# Altium schematic sheet Sheet1.SchDoc
size A; SheetNumber: 1; SheetTotal: 3
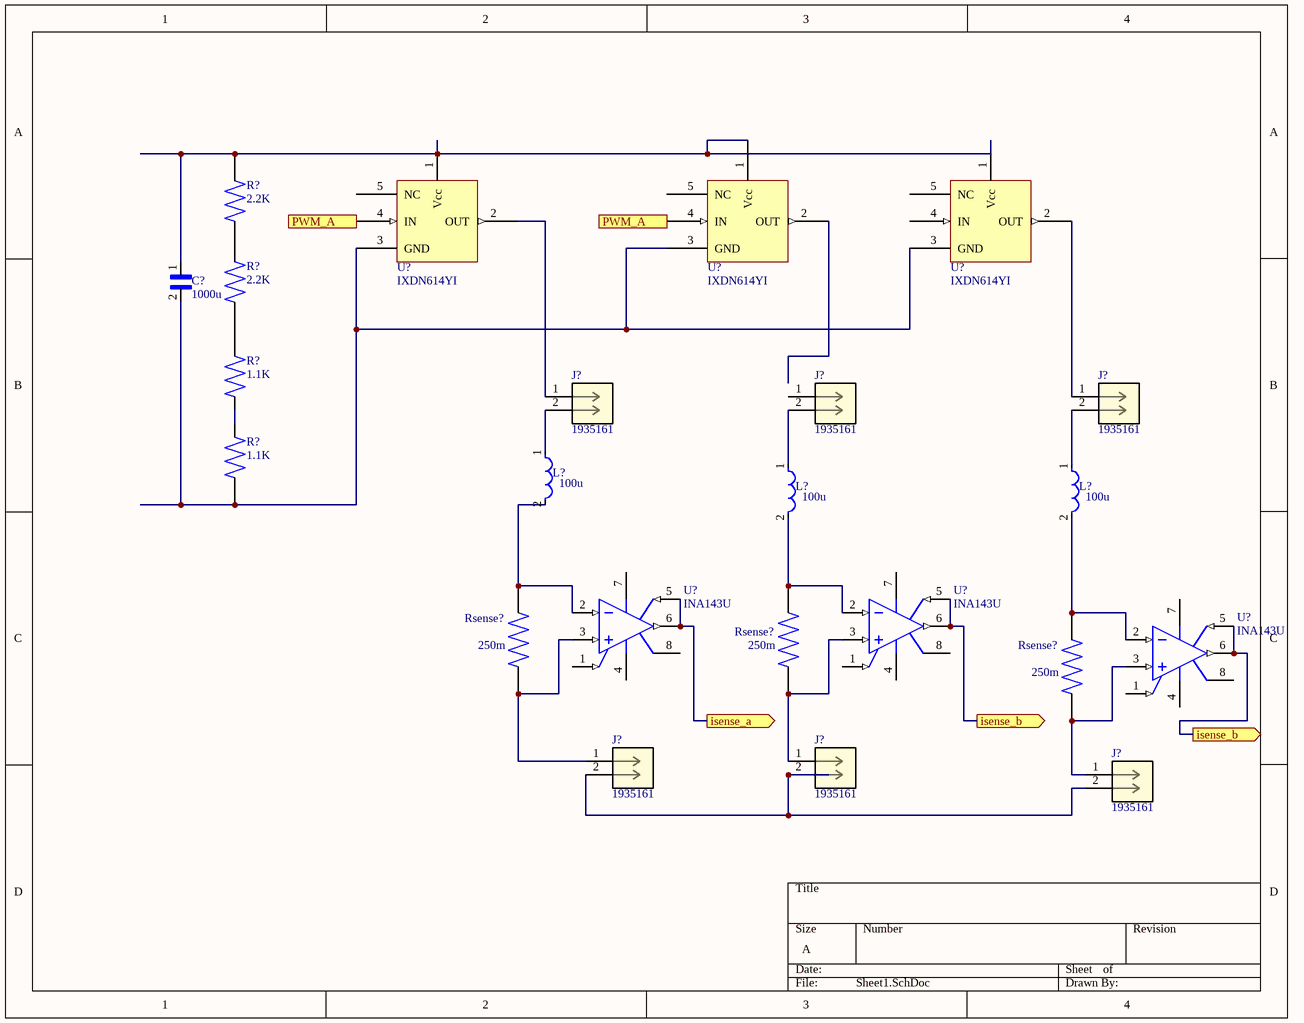
[diagram p0: Sheet1.SchDoc]

## Parts
(Parts that share a designator on the sheet are numbered #1, #2 ... from top to bottom, then left to right.)
C?  1000u
J?#1  1935161
J?#2  1935161
J?#3  1935161
J?#4  1935161
J?#5  1935161
J?#6  1935161
L?#1  100u
L?#2  100u
L?#3  100u
R?#1  2.2K
R?#2  2.2K
R?#3  1.1K
R?#4  1.1K
Rsense?#1  250m
Rsense?#2  250m
Rsense?#3  250m
U?#1  IXDN614YI
U?#2  IXDN614YI
U?#3  IXDN614YI
U?#4  INA143U
U?#5  INA143U
U?#6  INA143U

## Ports
isense_a (out), isense_b (out), PWM_A (in)

## Nets
isense_a: U?#4.5(SENSE) U?#4.6(OUTPUT) ; port isense_a
isense_b: U?#5.5(SENSE) U?#5.6(OUTPUT) U?#6.5(SENSE) U?#6.6(OUTPUT) ; port isense_b
PWM_A: U?#1.4(IN) U?#2.4(IN) ; port PWM_A
NetC?_1: C?.1 R?#1.1 U?#1.1(Vcc) U?#2.1(Vcc) U?#3.1(Vcc)
NetC?_2: C?.2 R?#4.2 U?#1.3(GND) U?#2.3(GND) U?#3.3(GND)
NetJ?#1_1: J?#1.1 U?#1.2(OUT)
NetJ?#1_2: J?#1.2 L?#1.1
NetJ?#2_2: J?#2.2 L?#2.1
NetJ?#3_1: J?#3.1 U?#3.2(OUT)
NetJ?#3_2: J?#3.2 L?#3.1
NetJ?#4_1: J?#4.1 Rsense?#1.1 U?#4.3(IN+)
NetJ?#4_2: J?#4.2 J?#5.2 J?#6.2
NetJ?#5_1: J?#5.1 Rsense?#2.1 U?#5.3(IN+)
NetJ?#6_1: J?#6.1 Rsense?#3.1 U?#6.3(IN+)
NetL?#1_2: L?#1.2 Rsense?#1.2 U?#4.2(IN-)
NetL?#2_2: L?#2.2 Rsense?#2.2 U?#5.2(IN-)
NetL?#3_2: L?#3.2 Rsense?#3.2 U?#6.2(IN-)
NetR?#2_2: R?#2.2 R?#3.1
NetR?#3_2: R?#3.2 R?#4.1

Not connected (* = marked no-connect by the designer): J?#2 1; R?#1 2; R?#2 1; U?#1 5(NC); U?#2 2(OUT) 5(NC); U?#3 4(IN) 5(NC); U?#4 1(REF) 4(V-) 7(V+) 8(NC); U?#5 1(REF) 4(V-) 7(V+) 8(NC); U?#6 1(REF) 4(V-) 7(V+) 8(NC)

## Library data of the parts
C? = EEU-FM1V102B: Cap Aluminum 1000uF 35V 20% (12.5 X 25mm) Radial 5mm 3190mA 7000 hr 105C Ammo Pack; Manufacturer: Panasonic; Capacitance: 1mF; Ripple Current: 3.19A; Life (Hours): 7000Hour; Impedance: 15mR; Polarity: Polar; Lead Diameter: 0.6mm; Supplier 1: Digi-Key; Manufacturer Part Number: EEU-FM1V102B; RoHS: Yes; Category: Aluminum Electrolytic Capacitors; Stock 1: 691; Pricing 1: 1=1.11000, 10=0.84300, 50=0.70060, 100=0.60330 (USD); Mount: Through Hole; Case/Package: Radial; Min Operating Temperature: -40°C; Max Operating Temperature: 105°C; Tolerance: 20%; Termination: Radial; Voltage Rating: 35V; Packaging: Tape and Reel; Package Quantity: 500; Voltage Rating (DC): 35V; ESR (Equivalent Series Resistance): 15mR; Series: FM; Construction: RADIAL; Diameter: 12mm; Length: 25mm; Height: 25mm; Lead Pitch: 5mm; Height - Seated (Max): 1.063inch; Radiation Hardening: No; Lead Free: Lead Free; RoHS Compliant: Yes; ComponentLink1URL: https://datasheet.ciiva.com/11676/aba0000ce108-11676917.pdf?src-supplier=Avnet; ComponentLink1Description: https://datasheet.ciiva.com/11676/aba0000ce108-11676917.pdf?src-supplier=Avnet; Supplier Part Number 1: P19719CT-ND
J?#1-J?#6 = 1935161: Conn Terminal Blocks 2 POS 5mm Solder ST Thru-Hole 16A; Manufacturer: Phoenix Contact; Max Supply Voltage: 250V; Current Rating: 17.5A; Number of Poles: 2; Number of Levels: 1; Current: 18A; Voltage: 300V; Voltage Rating (DC): 320V; Connector Type: Screw; Wire Gauge (Max): 26AWG; Wire Gauge (Min): 12AWG; Approvals: UL; Supplier 1: Digi-Key; Manufacturer Part Number: 1935161; RoHS: Yes; Category: Terminal Blocks; Stock 1: 82071; Pricing 1: 1=0.43000, 10=0.41400, 50=0.39600, 100=0.38520, 250=0.36000, 500=0.33120, 1000=0.30600 (USD); Mount: Through Hole; Number of Pins: 2; Color: Green; Weight: 0.067021oz; Material: Nylon; Housing Color: Green; Housing Material: Polyamide; Insulation Material: Nylon; Contact Material: Copper,Tin; Number of Rows: 1; Max Current Rating: 16A; Voltage Rating: 250V; Package Quantity: 250; Packaging: Bulk; Number of Positions: 2; Number of Positions Per Level: 2; Termination: Solder; Number of Contacts: 2; Number of Circuits: 2; Orientation: Straight; Series: COMBICON PT; Number of Ways: 2; Length: 9mm; Width: 14.9mm; Height: 11.3mm; Pitch: 5mm; Depth: 9mm; Wire/Cable Gauge: 26AWG; Radiation Hardening: No; Lead Free: Lead Free; Flammability Rating: UL94 V-0; REACH SVHC: Unknown; RoHS Compliant: Yes; ComponentLink1URL: https://datasheet.ciiva.com/15169/getdatasheetpartid-177903-15169663.pdf?src-supplier=Verical; ComponentLink1Description: https://datasheet.ciiva.com/15169/getdatasheetpartid-177903-15169663.pdf?src-supplier=Verical; ComponentLink2URL: https://datasheet.ciiva.com/16047/1935161-16047247.pdf?src-supplier=Onlinecomponents.com; ComponentLink2Description: https://datasheet.ciiva.com/16047/1935161-16047247.pdf?src-supplier=Onlinecomponents.com; ComponentLink3URL: https://datasheet.ciiva.com/824/combiconcompact5-0mmseries-824222.pdf?src-supplier=Digi-Key; ComponentLink3Description: https://datasheet.ciiva.com/824/combiconcompact5-0mmseries-824222.pdf?src-supplier=Digi-Key; Supplier Part Number 1: 277-1667-ND
L?#1-L?#3 = PA4344.104NLT: FIXED IND 100UH 5.3A 118 MOHM; Manufacturer: Pulse; Saturation Current: 6.5A; Shielding: Shielded; DC Resistance (DCR): 118mR; Test Frequency: 100kHz; Supplier 1: Digi-Key; Manufacturer Part Number: PA4344.104NLT; RoHS: Yes; Category: Fixed Inductors; Stock 1: 1739; Pricing 1: 1=3.77000, 10=3.59600, 25=3.42480, 50=2.87700, 100=2.46600 (USD); Mount: Surface Mount; Case/Package: Nonstandard; Min Operating Temperature: -40°C; Max Operating Temperature: 125°C; Packaging: Tape and Reel; Inductance: 100uH; Current Rating: 5.3A; Length: 0.697inch; Width: 0.677inch; Height - Seated (Max): 0.276inch; Ratings: AEC-Q200; RoHS Compliant: Yes; ComponentLink1URL: http://productfinder.pulseeng.com/products/datasheets/P771.pdf?src-supplier=Digi-Key; ComponentLink1Description: http://productfinder.pulseeng.com/products/datasheets/P771.pdf?src-supplier=Digi-Key; Supplier Part Number 1: 553-3011-1-ND
R?#1 R?#2 = RCS06032K49FKEA: Res Thick Film 0603 2.49K Ohm 1% 1/4W ±100ppm/°C Molded SMD Paper T/R; Manufacturer: Vishay Dale; Resistance: 2.49kR; Max Power Dissipation: 250mW; Supplier 1: Digi-Key; Manufacturer Part Number: RCS06032K49FKEA; RoHS: Yes; Category: Chip SMD Resistors; Pricing 1: 1=0.14000, 10=0.12700, 100=0.04900, 1000=0.02154, 2500=0.01860 (USD); Case/Package: 0603; Min Operating Temperature: -55°C; Max Operating Temperature: 155°C; Package Quantity: 5000; Packaging: Tape and Reel; Resistor Type: Thick Film; Number of Terminations: 2; Features: Automotive AEC-Q200; Tolerance: 1%; Temperature Coefficient: 100ppm/°C; Length: 0.061inch; Width: 0.033inch; Height: 0.02inch; ComponentLink1URL: http://www.vishay.com/docs/20065/rcse3.pdf?src-supplier=Digi-Key; ComponentLink1Description: http://www.vishay.com/docs/20065/rcse3.pdf?src-supplier=Digi-Key; Supplier Part Number 1: 541-RCS06032K49FKEACT-ND
R?#3 R?#4 = RCS06031K10FKEA: RES SMD 1.1K OHM 1% 1/4W 0603; Manufacturer: Vishay Dale; Max Power Dissipation: 250mW; Temperature Coefficient: 100ppm/°C; Resistance: 1.1kR; Supplier 1: Digi-Key; Manufacturer Part Number: RCS06031K10FKEA; RoHS: Yes; Category: Chip SMD Resistors; Stock 1: 4990; Pricing 1: 1=0.14000, 10=0.12700, 100=0.04900, 1000=0.02154, 2500=0.01860 (USD); Case/Package: 0603; Min Operating Temperature: -55°C; Max Operating Temperature: 155°C; Tolerance: 1%; Features: Automotive AEC-Q200; Package Quantity: 5000; Packaging: Tape and Reel; Resistor Type: Thick Film; Number of Terminations: 2; Length: 0.061inch; Width: 0.033inch; Height: 0.02inch; ComponentLink1URL: http://www.vishay.com/docs/20065/rcse3.pdf?src-supplier=Digi-Key; ComponentLink1Description: http://www.vishay.com/docs/20065/rcse3.pdf?src-supplier=Digi-Key; Supplier Part Number 1: 541-RCS06031K10FKEACT-ND
Rsense?#1-Rsense?#3 = 15FR250E: RESISTOR, R25, 1%, 5W; Product Range:OHMITE - 10 Series; Resistance:0.25ohm; Power Rating:5W; Resistance Tolerance:± 1%; Resistor Case Style:Axial Leaded; Resistor Element Material:Wirewound; Temperature Coefficient:± 50ppm/°C; ;RoHS Compliant: Yes; Manufacturer: Ohmite; Body Material: Silicone; Resistance: 250mR; Voltage Rating: 100mV; Voltage Rating (DC): 1kV; Lead Diameter: 0.05mm; Lead Length: 39.7mm; Supplier 1: Digi-Key; Manufacturer Part Number: 15FR250E; RoHS: Yes; Category: Through-Hole Resistors; Stock 1: 602; Pricing 1: 1=3.08000, 10=2.75000, 25=2.58480, 50=2.36500, 100=2.03500, 250=1.76000, 500=1.59500, 1000=1.46300 (USD); Mount: Through Hole; Case/Package: Axial; Min Operating Temperature: -55°C; Max Operating Temperature: 275°C; Tolerance: 1%; Power Rating: 5W; Packaging: Bulk; Package Quantity: 10; Resistor Type: Metal Element,Wirewound; Number of Terminations: 2; Termination: Axial; Temperature Coefficient: 50ppm/°C; Max Power Dissipation: 5W; Diameter: 8.4mm; Length: 23.8mm; REACH SVHC: Unknown; Lead Free: Lead Free; RoHS Compliant: Yes; ComponentLink1URL: https://datasheet.ciiva.com/2716/res-10-2716528.pdf?src-supplier=Digi-Key; ComponentLink1Description: https://datasheet.ciiva.com/2716/res-10-2716528.pdf?src-supplier=Digi-Key; ComponentLink2URL: https://datasheet.ciiva.com/16757/70022566-16757116.pdf?src-supplier=Allied+Electronics; ComponentLink2Description: https://datasheet.ciiva.com/16757/70022566-16757116.pdf?src-supplier=Allied+Electronics; ComponentLink3URL: https://datasheet.ciiva.com/15767/10-series-15767527.pdf?src-supplier=Onlinecomponents.com; ComponentLink3Description: https://datasheet.ciiva.com/15767/10-series-15767527.pdf?src-supplier=Onlinecomponents.com; ComponentLink4URL: https://datasheet.ciiva.com/7984/10-series-7984797.pdf?src-supplier=Element14; ComponentLink4Description: https://datasheet.ciiva.com/7984/10-series-7984797.pdf?src-supplier=Element14; ComponentLink5URL: https://datasheet.ciiva.com/1131/1851651-1131711.pdf?src-supplier=Element14; ComponentLink5Description: https://datasheet.ciiva.com/1131/1851651-1131711.pdf?src-supplier=Element14; Supplier Part Number 1: 15FR250E-ND
U?#1-U?#3 = IXDN614YI: 14-Ampere Low-Side Ultrafast Mosfet Driver 5-Lead To-263 Rohs Compliant: Yes; Manufacturer: Ixys Clare; Rise Time: 35ns; Propagation Delay: 70ns; Max Supply Voltage: 35V; Max Output Current: 14A; Min Supply Voltage: 4.5V; Number of Outputs: 1; Fall Time: 25ns; Supplier 1: Digi-Key; Manufacturer Part Number: IXDN614YI; RoHS: Yes; Category: Gate Drivers; Pricing 1: 1=5.45000, 10=4.89400, 25=4.62640, 100=3.80390, 250=3.41328, 500=3.28990, 1000=2.73473, 2500=2.71572 (USD); Mount: Surface Mount; Case/Package: TO-263-6; Min Operating Temperature: -40°C; Max Operating Temperature: 125°C; Packaging: Rail/Tube; Package Quantity: 50; Number of Drivers: 1; Turn-On Delay Time: 70ns; Series: -; Lead Free: Lead Free; RoHS Compliant: Yes; ComponentLink1URL: https://datasheet.ciiva.com/6612/ixd-614-6612987.pdf?src-supplier=Digi-Key; ComponentLink1Description: https://datasheet.ciiva.com/6612/ixd-614-6612987.pdf?src-supplier=Digi-Key; Supplier Part Number 1: IXDN614YI-ND
U?#4-U?#6 = INA143U: SP Amp Difference Amplifier Single ±18V/36V 8-Pin SOIC Tube; Manufacturer: Texas Instruments; Dual Supply Voltage: 15V; Min Dual Supply Voltage: 2.25V; Max Dual Supply Voltage: 18V; Bandwidth: 150kHz; Nominal Supply Current: 950uA; Common Mode Rejection Ratio: 86dB; Number of Channels: 1; Slew Rate: 5V/µs; Max Supply Voltage: 36V; Min Supply Voltage: 4.5V; Input Offset Voltage (Vos): 100uV; Voltage Gain: 20dB; Input Resistance: 55kR; Output Current per Channel: 32mA; Settling Time: 6us; Supplier 1: Digi-Key; Manufacturer Part Number: INA143U; RoHS: Yes; Category: Amplifiers - Op Amps, Buffer, Instrumentation; Stock 1: 417; Pricing 1: 1=4.01000, 10=3.60000, 25=3.40320, 100=2.79830, 250=2.51096, 500=2.42020, 1000=2.01178, 2500=1.99780 (USD); Case/Package: D; Number of Pins: 8; Weight: 0.002677oz; Min Operating Temperature: -40°C; Max Operating Temperature: 85°C; Package Quantity: 75; Packaging: Rail/Tube; Number of Circuits: 1; Number of Elements: 1; Quiescent Current: 950uA; Gain Bandwidth Product: 150kHz; -3db Bandwidth: 150kHz; Operating Supply Current: 950uA; Max Input Voltage: 36V; Min Input Voltage: 2.25V; Number of Amplifiers: 1; Length: 4.9mm; Width: 3.91mm; Height: 1.58mm; Radiation Hardening: No; Lead Free: Lead Free; REACH SVHC: No SVHC; ComponentLink1URL: https://datasheet.ciiva.com/19474/1341122-19474592.pdf?src-supplier=Jameco; ComponentLink1Description: https://datasheet.ciiva.com/19474/1341122-19474592.pdf?src-supplier=Jameco; ComponentLink2URL: https://datasheet.ciiva.com/15128/getdatasheetpartid-49975-15128159.pdf?src-supplier=Verical; ComponentLink2Description: https://datasheet.ciiva.com/15128/getdatasheetpartid-49975-15128159.pdf?src-supplier=Verical; ComponentLink3URL: https://datasheet.ciiva.com/1799/ina143-1799971.pdf?src-supplier=Digi-Key; ComponentLink3Description: https://datasheet.ciiva.com/1799/ina143-1799971.pdf?src-supplier=Digi-Key; ComponentLink4URL: https://datasheet.ciiva.com/2976/ina2143-2976117.pdf?src-supplier=Avnet; ComponentLink4Description: https://datasheet.ciiva.com/2976/ina2143-2976117.pdf?src-supplier=Avnet; ComponentLink5URL: https://datasheet.ciiva.com/26191/sbos116-26191078.pdf?src-supplier=Avnet+Europe; ComponentLink5Description: https://datasheet.ciiva.com/26191/sbos116-26191078.pdf?src-supplier=Avnet+Europe; ComponentLink6URL: https://datasheet.ciiva.com/1485/693952-1485228.pdf?src-supplier=Element14; ComponentLink6Description: https://datasheet.ciiva.com/1485/693952-1485228.pdf?src-supplier=Element14; ComponentLink7URL: https://datasheet.ciiva.com/48707/001010602-da-01-en-ic-opamp-diff-150khz-ina143u-soic-8-tid-48707338.pdf?src-supplier=Conrad; ComponentLink7Description: https://datasheet.ciiva.com/48707/001010602-da-01-en-ic-opamp-diff-150khz-ina143u-soic-8-tid-48707338.pdf?src-supplier=Conrad; Supplier Part Number 1: INA143U-ND